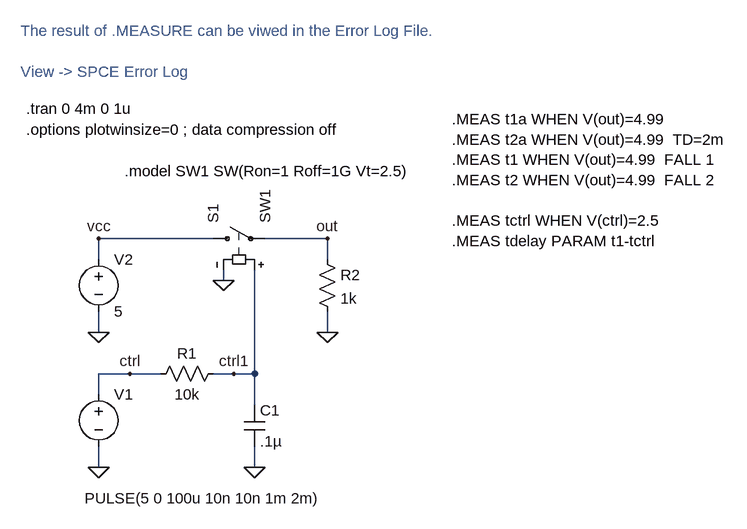
[diagram p0: schematic measure_delay1.asc]
measure_delay1.asc, the LTspice schematic file:
Version 4
SHEET 1 1124 680
WIRE 208 0 32 0
WIRE 384 0 288 0
WIRE 32 32 32 0
WIRE 384 32 384 0
WIRE 224 64 224 48
WIRE 32 144 32 112
WIRE 384 144 384 112
WIRE 80 208 32 208
WIRE 128 208 80 208
WIRE 240 208 208 208
WIRE 272 208 272 48
WIRE 272 208 240 208
WIRE 32 240 32 208
WIRE 272 256 272 208
WIRE 32 352 32 320
WIRE 272 352 272 320
FLAG 32 352 0
FLAG 272 352 0
FLAG 384 144 0
FLAG 224 64 0
FLAG 32 144 0
FLAG 384 0 out
FLAG 240 208 ctrl1
FLAG 32 0 vcc
FLAG 80 208 ctrl
SYMBOL voltage 32 224 R0
WINDOW 3 -22 176 Left 0
WINDOW 123 0 0 Left 0
WINDOW 39 0 0 Left 0
SYMATTR InstName V1
SYMATTR Value PULSE(5 0 100u 10n 10n 1m 2m)
SYMBOL res 112 224 R270
WINDOW 0 32 56 VTop 0
WINDOW 3 0 56 VBottom 0
SYMATTR InstName R1
SYMATTR Value 10k
SYMBOL cap 256 256 R0
SYMATTR InstName C1
SYMATTR Value .1µ
SYMBOL sw 192 0 R270
SYMATTR InstName S1
SYMATTR Value SW1
SYMBOL res 368 16 R0
SYMATTR InstName R2
SYMATTR Value 1k
SYMBOL voltage 32 16 R0
SYMATTR InstName V2
SYMATTR Value 5
TEXT 72 -104 Left 0 !.model SW1 SW(Ron=1 Roff=1G Vt=2.5)
TEXT -80 -200 Left 0 !.tran 0 4m 0 1u
TEXT -80 -168 Left 0 !.options plotwinsize=0 ; data compression off
TEXT 576 -184 Left 0 !.MEAS t1a WHEN V(out)=4.99  \n.MEAS t2a WHEN V(out)=4.99  TD=2m\n.MEAS t1 WHEN V(out)=4.99  FALL 1\n.MEAS t2 WHEN V(out)=4.99  FALL 2\n \n.MEAS tctrl WHEN V(ctrl)=2.5\n.MEAS tdelay PARAM t1-tctrl
TEXT -88 -320 Left 0 ;The result of .MEASURE can be viwed in the Error Log File.\n \nView -> SPCE Error Log

The netlist it stands for:
* measure_delay1.asc
V1 ctrl 0 PULSE(5 0 100u 10n 10n 1m 2m)
R1 ctrl ctrl1 10k
C1 ctrl1 0 .1µ
S1 vcc out ctrl1 0 SW1
R2 out 0 1k
V2 vcc 0 5
.model SW1 SW(Ron=1 Roff=1G Vt=2.5)
.tran 0 4m 0 1u
.options plotwinsize=0 ; data compression off
.MEAS t1a WHEN V(out)=4.99
.MEAS t2a WHEN V(out)=4.99  TD=2m
.MEAS t1 WHEN V(out)=4.99  FALL 1
.MEAS t2 WHEN V(out)=4.99  FALL 2
.MEAS tctrl WHEN V(ctrl)=2.5
.MEAS tdelay PARAM t1-tctrl
* The result of .MEASURE can be viwed in the Error Log File.
* View -> SPCE Error Log
.backanno
.end